# Altium schematic sheet 1_P1.schdoc
size 309 x 223 mm; Symbol: Sheet-Symbol_A4; Device: Sheet-Symbol_A4; @Page Name: P1; @Create Date: 2023-07-07; @Page Count: 1; @Page No: 1; @Project Name: 51第二形态; @Schematic Name: Schematic1; @Update Date: 2023-07-07; Company: 嘉立创EDA; Page Size: A4; Version: V1.0
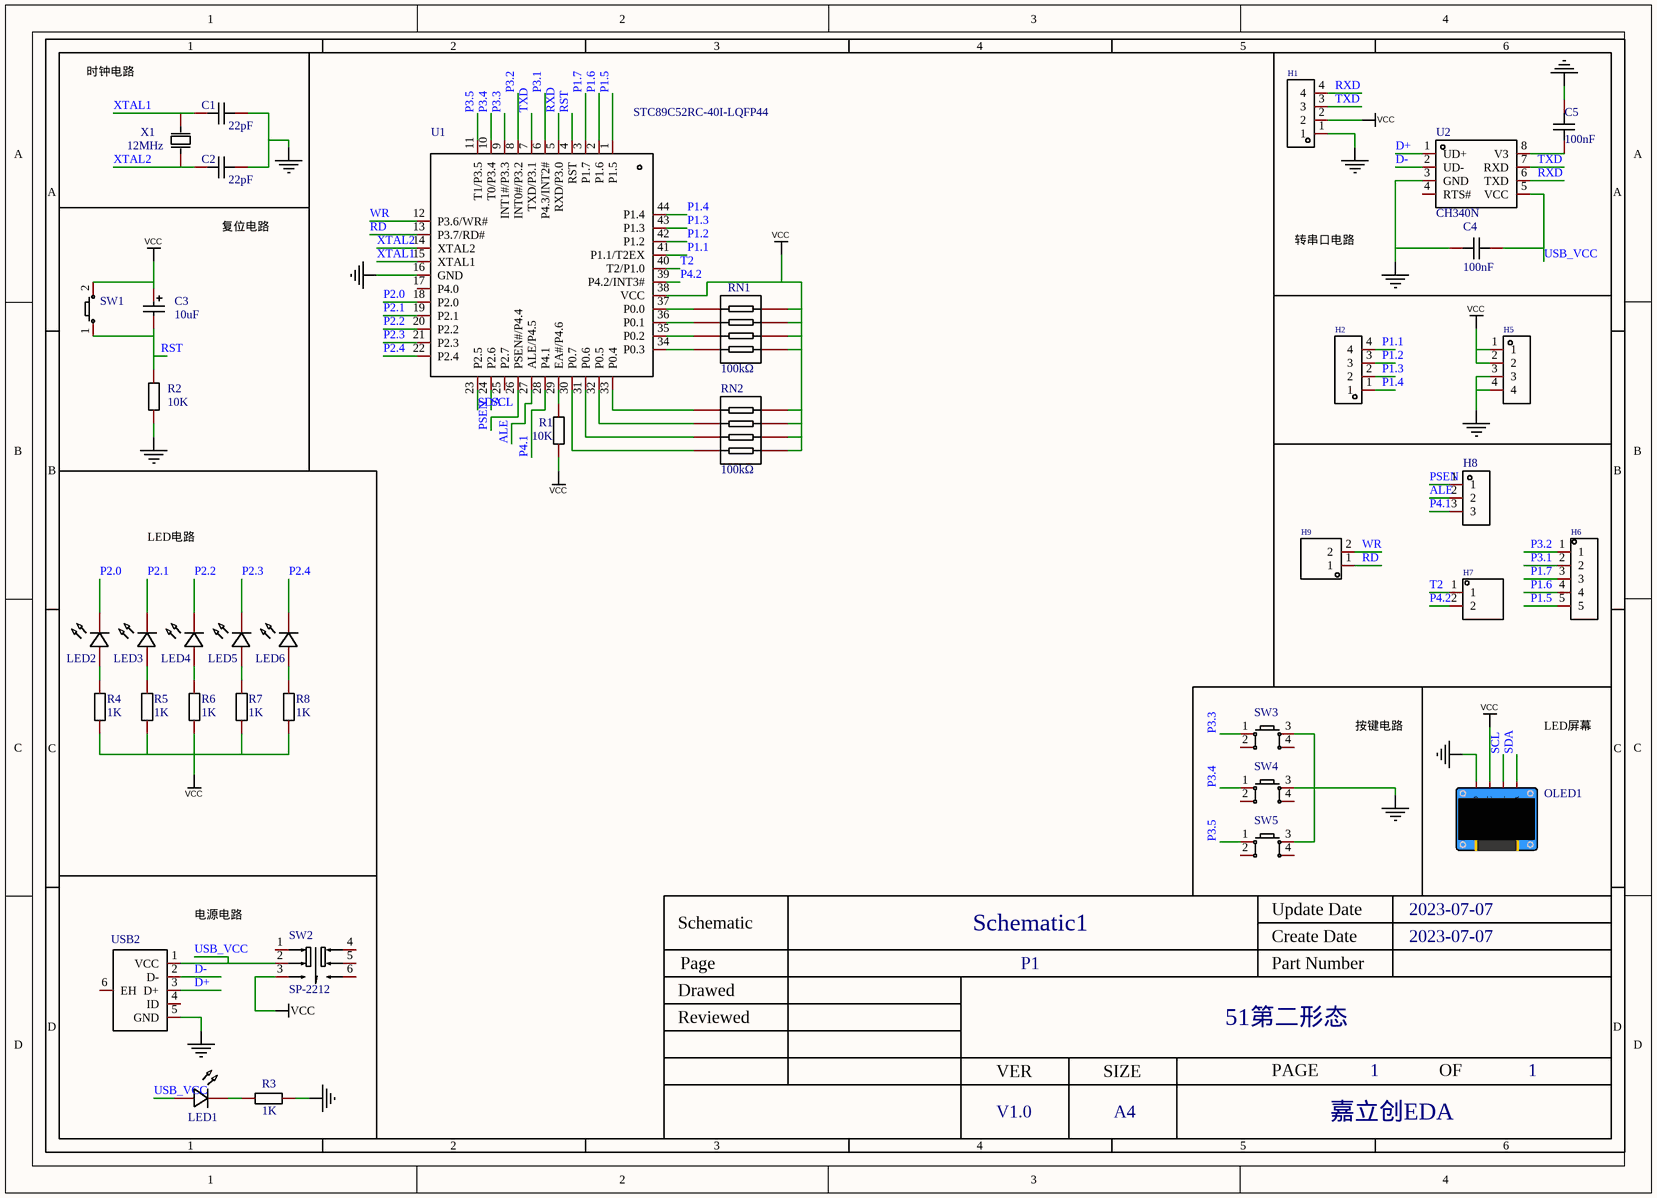
[diagram p0: 1_P1.schdoc]

## Parts
C1  22pF  [C0603]
C2  22pF  [C0603]
C3  10uF  [C_Ele_SMD_3x5.4mm]
C4  100nF  [C0603]
C5  100nF  [C0603]
H1  HDR-M_2.54_1x4P  [HDR-TH_4P-P2.54-V-M]  (value not drawn)
H2  HDR-M_2.54_1x4P  [HDR-TH_4P-P2.54-V-M]  (value not drawn)
H5  HDR-M_2.54_1x4P  [HDR-TH_4P-P2.54-V-M]  (value not drawn)
H6  HDR-M_2.54_1x5P  [HDR-TH_5P-P2.54-V-M]  (value not drawn)
H7  HDR-M_2.54_1x2P  [HDR-TH_2P-P2.54-V-M-1]  (value not drawn)
H8  HDR-M_2.54_1x3P  [HDR-TH_3P-P2.54-V-M]  (value not drawn)
H9  HDR-M_2.54_1x2P  [HDR-TH_2P-P2.54-V-M-1]  (value not drawn)
LED1  LED_TH-R_3mm  [LED_TH-3mm]  (value not drawn)
LED2  LED_TH-R_3mm  [LED_TH-3mm]  (value not drawn)
LED3  LED_TH-R_3mm  [LED_TH-3mm]  (value not drawn)
LED4  LED_TH-R_3mm  [LED_TH-3mm]  (value not drawn)
LED5  LED_TH-R_3mm  [LED_TH-3mm]  (value not drawn)
LED6  LED_TH-R_3mm  [LED_TH-3mm]  (value not drawn)
OLED1  0.96OLED模块_4P  [0.96OLED_4P]  (value not drawn)
R1  10K  [R0603]
R2  10K  [R0603]
R3  1K  [R0603]
R4  1K  [R0603]
R5  1K  [R0603]
R6  1K  [R0603]
R7  1K  [R0603]
R8  1K  [R0603]
RN1  100kΩ  [RES-ARRAY-SMD_0603-8P-L3.2-W1.6-BL]
RN2  100kΩ  [RES-ARRAY-SMD_0603-8P-L3.2-W1.6-BL]
SW1  Key_SMD_3x4x2  [Key_SMD_3x4x2]  (value not drawn)
SW2  SP-2212  [SW-TH_6P-L7.2-W7.2-P2.00-LS5.0]
SW3  Key_SMD_12x12x7.3  [Key_SMD_12x12x7.3]  (value not drawn)
SW4  Key_SMD_12x12x7.3  [Key_SMD_12x12x7.3]  (value not drawn)
SW5  Key_SMD_12x12x7.3  [Key_SMD_12x12x7.3]  (value not drawn)
U1  STC89C52RC-40I-LQFP44  [LQFP-44_L10.0-W10.0-P0.80-LS12.0-BL]
U2  CH340N  [SOP-8_L4.9-W3.9-P1.27-LS6.0-BL]
USB2  USB_Micro-B  [USB_Micro]  (value not drawn)
X1  12MHz  [HC-49US_L11.5-W4.5-P4.88]

## Nets
NetC1_2: C1.2 C2.2 C4.1 C5.2 H1.1 H5.3 H5.4 OLED1.1(GND) R2.1 R3.2 SW3.3 SW4.3 SW5.3 U1.16(GND) U2.3(GND) USB2.5(GND)
VCC: C3.1 H1.2 H5.1 H5.2 OLED1.2(VCC) R1.1 R4.1 R5.1 R6.1 R7.1 R8.1 RN1.5 RN1.6 RN1.7 RN1.8 RN2.1 RN2.2 RN2.3 RN2.4 SW1.2 SW2.3 U1.38(VCC)
ALE: H8.2 U1.27(ALE/P4.5)
D+: U2.1(UD+) USB2.3(D+)
D-: U2.2(UD-) USB2.2(D-)
P1.1: H2.4 U1.41(P1.1/T2EX)
P1.2: H2.3 U1.42(P1.2)
P1.3: H2.2 U1.43(P1.3)
P1.4: H2.1 U1.44(P1.4)
P1.5: H6.5 U1.1(P1.5)
P1.6: H6.4 U1.2(P1.6)
P1.7: H6.3 U1.3(P1.7)
P2.0: LED2.2(A) U1.18(P2.0)
P2.1: LED3.2(A) U1.19(P2.1)
P2.2: LED4.2(A) U1.20(P2.2)
P2.3: LED5.2(A) U1.21(P2.3)
P2.4: LED6.2(A) U1.22(P2.4)
P3.1: H6.2 U1.6(P4.3/INT2#)
P3.2: H6.1 U1.8(INT0#/P3.2)
P3.3: SW3.1 U1.9(INT1#/P3.3)
P3.4: SW4.1 U1.10(T0/P3.4)
P3.5: SW5.1 U1.11(T1/P3.5)
P4.1: H8.3 U1.28(P4.1)
P4.2: H7.2 U1.39(P4.2/INT3#)
PSEN: H8.1 U1.26(PSEN#/P4.4)
RD: H9.1 U1.13(P3.7/RD#)
RST: C3.2 R2.2 SW1.1 U1.4(RST)
RXD: H1.4 U1.5(RXD/P3.0) U2.6(TXD)
SCL: OLED1.3(SCL) U1.24(P2.6)
SDA: OLED1.4(SDA) U1.23(P2.5)
T2: H7.1 U1.40(T2/P1.0)
TXD: H1.3 U1.7(TXD/P3.1) U2.7(RXD)
USB_VCC: C4.2 LED1.1(C) SW2.2 U2.5(VCC) USB2.1(VCC)
WR: H9.2 U1.12(P3.6/WR#)
XTAL1: C1.1 U1.15(XTAL1) X1.1(OSC1)
XTAL2: C2.1 U1.14(XTAL2) X1.2(OSC2)
NetC5_1: C5.1 U2.8(V3)
NetLED1_2: LED1.2(A) R3.1
NetLED2_1: LED2.1(C) R4.2
NetLED3_1: LED3.1(C) R5.2
NetLED4_1: LED4.1(C) R6.2
NetLED5_1: LED5.1(C) R7.2
NetLED6_1: LED6.1(C) R8.2
NetR1_2: R1.2 U1.29(EA#/P4.6)
NetRN1_1: RN1.1 U1.37(P0.0)
NetRN1_2: RN1.2 U1.36(P0.1)
NetRN1_3: RN1.3 U1.35(P0.2)
NetRN1_4: RN1.4 U1.34(P0.3)
NetRN2_5: RN2.5 U1.33(P0.4)
NetRN2_6: RN2.6 U1.32(P0.5)
NetRN2_7: RN2.7 U1.31(P0.6)
NetRN2_8: RN2.8 U1.30(P0.7)

Not connected (* = marked no-connect by the designer): SW2 1 4 5 6; SW3 2 4; SW4 2 4; SW5 2 4; U1 17(P4.0) 25(P2.7); U2 4(RTS#); USB2 4(ID) 6(EH)

## Notes on the sheet
- 时钟电路
- 复位电路
- 转串口电路
- LED电路
- 按键电路
- LED屏幕
- 电源电路
- 1
- 2
- 3
- 4
- 5
- 6
- A
- B
- C
- Schematic
- Schematic1
- Create Date
- Update Date
- 2023-07-07
- Reviewed
- Drawed
- Page
- P1
- Part Number
- 51第二形态
- D
- VER
- SIZE
- PAGE
- OF
- V1.0
- A4
- 嘉立创EDA

## Library data of the parts
C1 C2 = CC0603KRX7R9BB104: 容值:100nF;精度:±10%;额定电压:50V;材质(温度系数):X7R;; Manufacturer: YAGEO(国巨); Add into BOM: yes; Tolerance: ±10%; Voltage Rated: 50V; Temperature Coefficient: X7R; Name: 22pF; Symbol: CC0603KRX7R9BB104; Device: CC0603KRX7R9BB104; LCSC Part Name: 100nF ±10% 50V; Supplier Part: C14663; Manufacturer Part: CC0603KRX7R9BB104; Supplier Footprint: 0603; JLCPCB Part Class: Basic Part; Datasheet: https://atta.szlcsc.com/upload/public/pdf/source/20180910/C282072_33301C7F631E79921B82A8DAC6BCC5B3.pdf; Supplier: LCSC; Convert to PCB: yes; Value: 22pF
C3 = C_Ele_SMD_3x5.4mm: Symbol: CAP; Add into BOM: yes; Name: 10uF; Device: C_Ele_SMD_3x5.4mm; Supplier Footprint: SMD,3x5.4mm; Convert to PCB: yes; Value: 10uF
C4 C5 = CAP_0603: Symbol: CapAcitance; Convert to PCB: yes; Name: 100nF; Device: CAP_0603; Add into BOM: yes; Supplier Footprint: 0603; Value: 100nF
H1 H2 H5 = HDR-M_2.54_1x4P: Manufacturer: XFCN(兴飞); Symbol: PZ254V-11-04P; Convert to PCB: yes; Device: HDR-M_2.54_1x4P; Add into BOM: yes; Supplier Part: C492403; Supplier Footprint: 插件; Supplier: LCSC; Manufacturer Part: PZ254V-11-04P; JLCPCB Part Class: Extended Part
H6 = HDR-M_2.54_1x5P: Manufacturer: MINTRON(明硕); Symbol: MTP125-1105S1; Convert to PCB: yes; Device: HDR-M_2.54_1x5P; Add into BOM: yes; Supplier Part: C358687; Supplier Footprint: 插件; Supplier: LCSC; Manufacturer Part: MTP125-1105S1; JLCPCB Part Class: Extended Part
H7 H9 = HDR-M_2.54_1x2P: Manufacturer: Ckmtw(灿科盟); Manufacturer Part: B-2100S02P-A110; Symbol: 210S-1*2P L=11.6MMGold-plated black; Convert to PCB: yes; Device: HDR-M_2.54_1x2P; Add into BOM: yes; Supplier Part: C124375; Supplier Footprint: 插件; Supplier: LCSC; JLCPCB Part Class: Extended Part
H8 = HDR-M_2.54_1x3P: Symbol: PZ254V-11-03P_C2937625; Convert to PCB: yes; Device: HDR-M_2.54_1x3P; Add into BOM: yes; Supplier Part: C2937625; Supplier Footprint: 插件
LED1-LED6 = LED_TH-R_3mm: Convert to PCB: yes; Symbol: LED_TH-R; Device: LED_TH-R_3mm; Add into BOM: yes; Supplier Footprint: 插件
OLED1 = 0.96OLED模块_4P: Convert to PCB: yes; Symbol: 0.96OLED模块_4P; Device: 0.96OLED模块_4P; Add into BOM: yes; Supplier Footprint: 插件
R1-R8 = Res_0603: Symbol: 电阻; Convert to PCB: yes; Device: Res_0603; Add into BOM: yes; Supplier Footprint: 0603
  R1 R2: Name: 10K; Value: 10K
  R3-R8: Name: 1K; Value: 1K
RN1 RN2 = 4D03WGJ0103T5E: 阻值:10kΩ;精度:±5%;单个元件功率:62.5mW;电阻器数:4;; Manufacturer: UNI-ROYAL(厚声); Add into BOM: yes; Tolerance: ±5%; Power(Watts): 62.5mW; Number of Resistors: 4; Temperature Coefficient: ±200ppm/℃; Name: 100kΩ; Symbol: 4D03WGJ0103T5E; Device: 4D03WGJ0103T5E; LCSC Part Name: 10kΩ ±5%; Supplier Part: C29718; Manufacturer Part: 4D03WGJ0103T5E; Supplier Footprint: 0603x4; JLCPCB Part Class: Basic Part; Datasheet: https://atta.szlcsc.com/upload/public/pdf/source/20170615/1497511005633.pdf; Supplier: LCSC; Convert to PCB: yes; Value: 100kΩ; Number of Pins: 8
SW1 = Key_SMD_3x4x2: Symbol: 轻触按键x2; Convert to PCB: yes; Device: Key_SMD_3x4x2; Add into BOM: yes; Supplier Footprint: SMD
SW2 = SP-2212: 触点电流:100mA;额定电压 (DC):30V;绝缘电阻:100MΩ;电路结构:双刀双掷;安装方式:直插;自锁/无锁:自锁;按键形状:矩形柱塞;按键/盖帽颜色:蓝色;引脚样式:PC引脚;作用力:230gf@±50gf;机械寿命:12000;; Manufacturer: RISHENG(日昇); Add into BOM: yes; Contact Current: 100mA; Voltage Rating (DC): 30V; Insulation Resistance: 100MΩ; Circuit: 双刀双掷; Self Lock / No Lock: 自锁; Actuator Style: 矩形柱塞; Actuator/Cap Color: 蓝色; Pin Style: PC引脚; Mechanical Life: 12000; Name: SP-2212; Symbol: SP-2212; Device: SP-2212; LCSC Part Name: 轻触开关自锁; Supplier Part: C589287; Manufacturer Part: SP-2212; Supplier Footprint: 插件; JLCPCB Part Class: Extended Part; Datasheet: https://atta.szlcsc.com/upload/public/pdf/source/20200922/C589287_2DDFEABD4C802D7BFB6520C1CABFFDEF.pdf; Supplier: LCSC; Convert to PCB: yes; Mounting Style: 直插; Operating Force: 230gf@±50gf; NO_CONNECT: yes
SW3-SW5 = Key_SMD_12x12x7.3: Symbol: 轻触按键; Convert to PCB: yes; Device: Key_SMD_12x12x7.3; Add into BOM: yes; Supplier Footprint: SMD; NO_CONNECT: yes
U1 = STC89C52RC-40I-LQFP44: CPU内核:51系列;CPU最大主频:-;程序存储容量:8KB;程序存储器类型:FLASH;RAM总容量:512Byte;GPIO端口数量:39;; Manufacturer: STC(宏晶); Symbol: STC89C52RC-40I_C8707; Add into BOM: yes; CPU Core: 51系列; Operating Voltage Range: 3.3V~5.5V; Program Storage Size: 8KB; Program Memory Type: FLASH; GPIO Ports Number: 39; 16Bit Timer: 3; UART/USART: 1; Peripheral/Function: 看门狗; Watchdog: 有; Name: STC89C52RC-40I-LQFP44; Device: STC89C52RC-40I-LQFP44; LCSC Part Name: 51系列; Supplier Part: C8707; Manufacturer Part: STC89C52RC-40I-LQFP44; Supplier Footprint: LQFP-44(10x10); JLCPCB Part Class: Extended Part; Datasheet: https://atta.szlcsc.com/upload/public/pdf/source/20120807/1457706521177.pdf; Supplier: LCSC; Convert to PCB: yes; CPU Maximum Speed: -; RAM Size: 512Byte; EEPROM: -; ADC (Bit): -; DAC (Bit): -; PWM (Bit): -; 8Bit Timer: -; 32Bit Timer: -; CAN: -; I2C: -; I2S: -; SPI: -; Universal Serial Bus: -; Internal Comparator: -; communication protocol: -; Real-Time Clock: -; Infrared Data Association: -; Low-Voltage Detect: -; CCP Capture/Compare: -; Secure Digital Input and Output: -; Direct Memory Access: -; Internal Oscillator: -; Operating Temperature Range: -40℃~+85℃; NO_CONNECT: yes
U2 = CH340N: Manufacturer: WCH(南京沁恒); Symbol: CH340N_C2977777; Add into BOM: yes; Name: CH340N; Device: CH340N; LCSC Part Name: USB转串口芯片 CH340; Supplier Part: C2977777; Manufacturer Part: CH340N; Supplier Footprint: SOP-8; JLCPCB Part Class: Extended Part; Datasheet: https://atta.szlcsc.com/upload/public/pdf/source/20220223/82A45E4FF89B3EDCAD50B354450A7EF4.pdf; Supplier: LCSC; Convert to PCB: yes; NO_CONNECT: yes
USB2 = USB_Micro-B: Add into BOM: yes; Symbol: USB_Micro; Device: USB_Micro-B; Convert to PCB: yes; Supplier Footprint: SMD; NO_CONNECT: yes
X1 = X49SD12MSD2SC: 频率:12MHz;频率公差:±20ppm;负载电容:20pF;; Manufacturer: YXC(扬兴晶振); Add into BOM: yes; Crystal Type: 49S晶振; Frequency Tolerance: ±20ppm; Frequency Stability: ±30ppm; Load Capacitance: 20pF; Name: 12MHz; Symbol: X49SD12MSD2SC; Device: X49SD12MSD2SC; LCSC Part Name: 12MHz ±20ppm 20pF HC-49US; Supplier Part: C16369; Manufacturer Part: X49SD12MSD2SC; Supplier Footprint: HC-49S; JLCPCB Part Class: Extended Part; Datasheet: https://atta.szlcsc.com/upload/public/pdf/source/20210903/A997D130AE99CBB55D9024F9BE6DA174.pdf; Supplier: LCSC; Convert to PCB: yes; Value: 12MHz; Operating Temperature: -20℃~+70℃